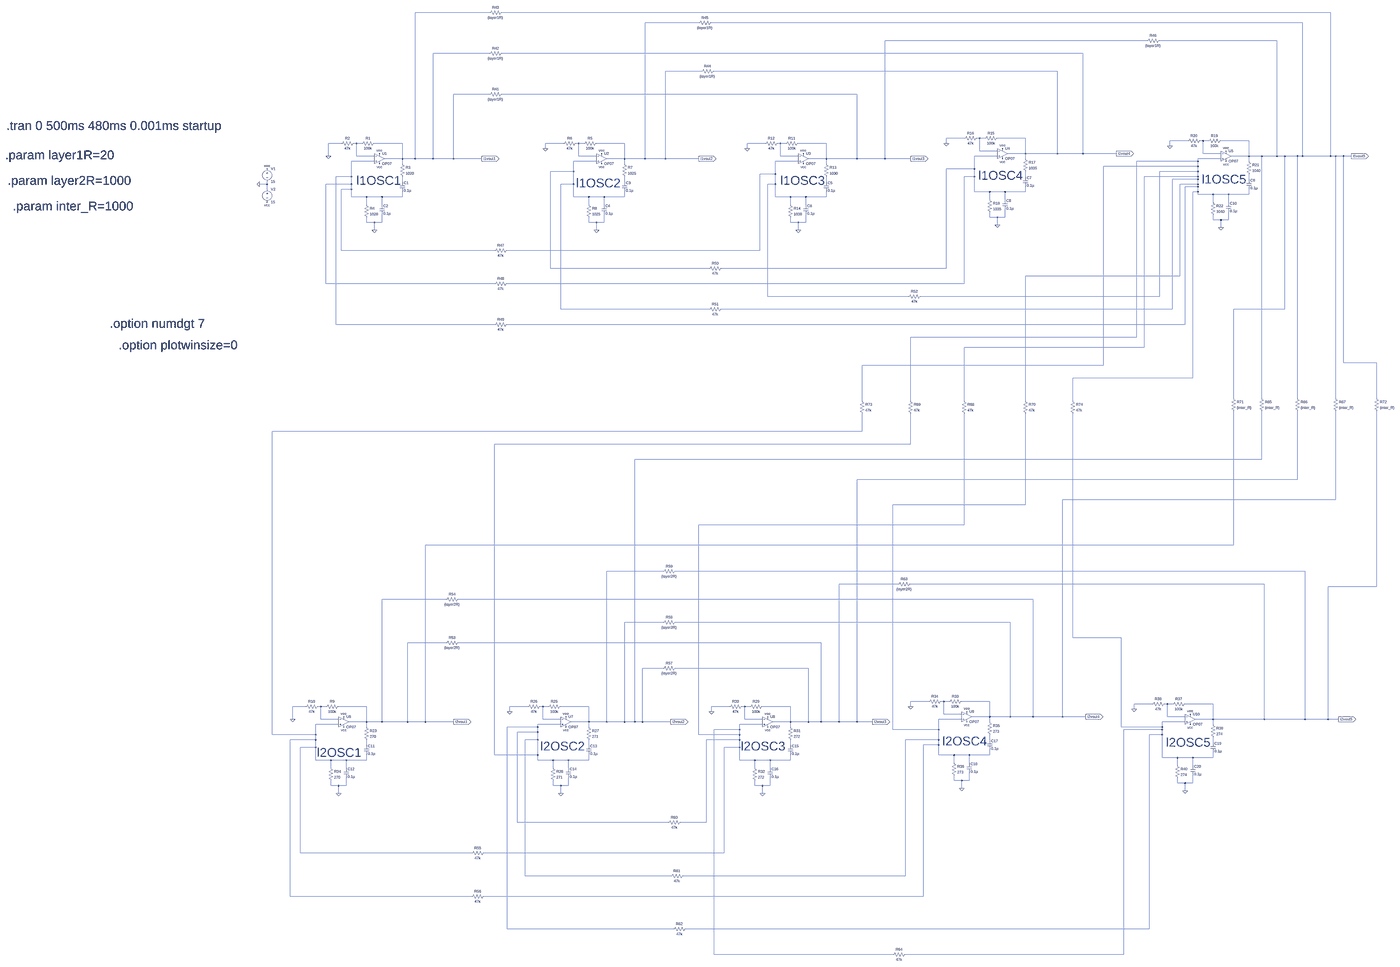
[diagram p0: schematic coupled_wein_bridge.asc, whole sheet]
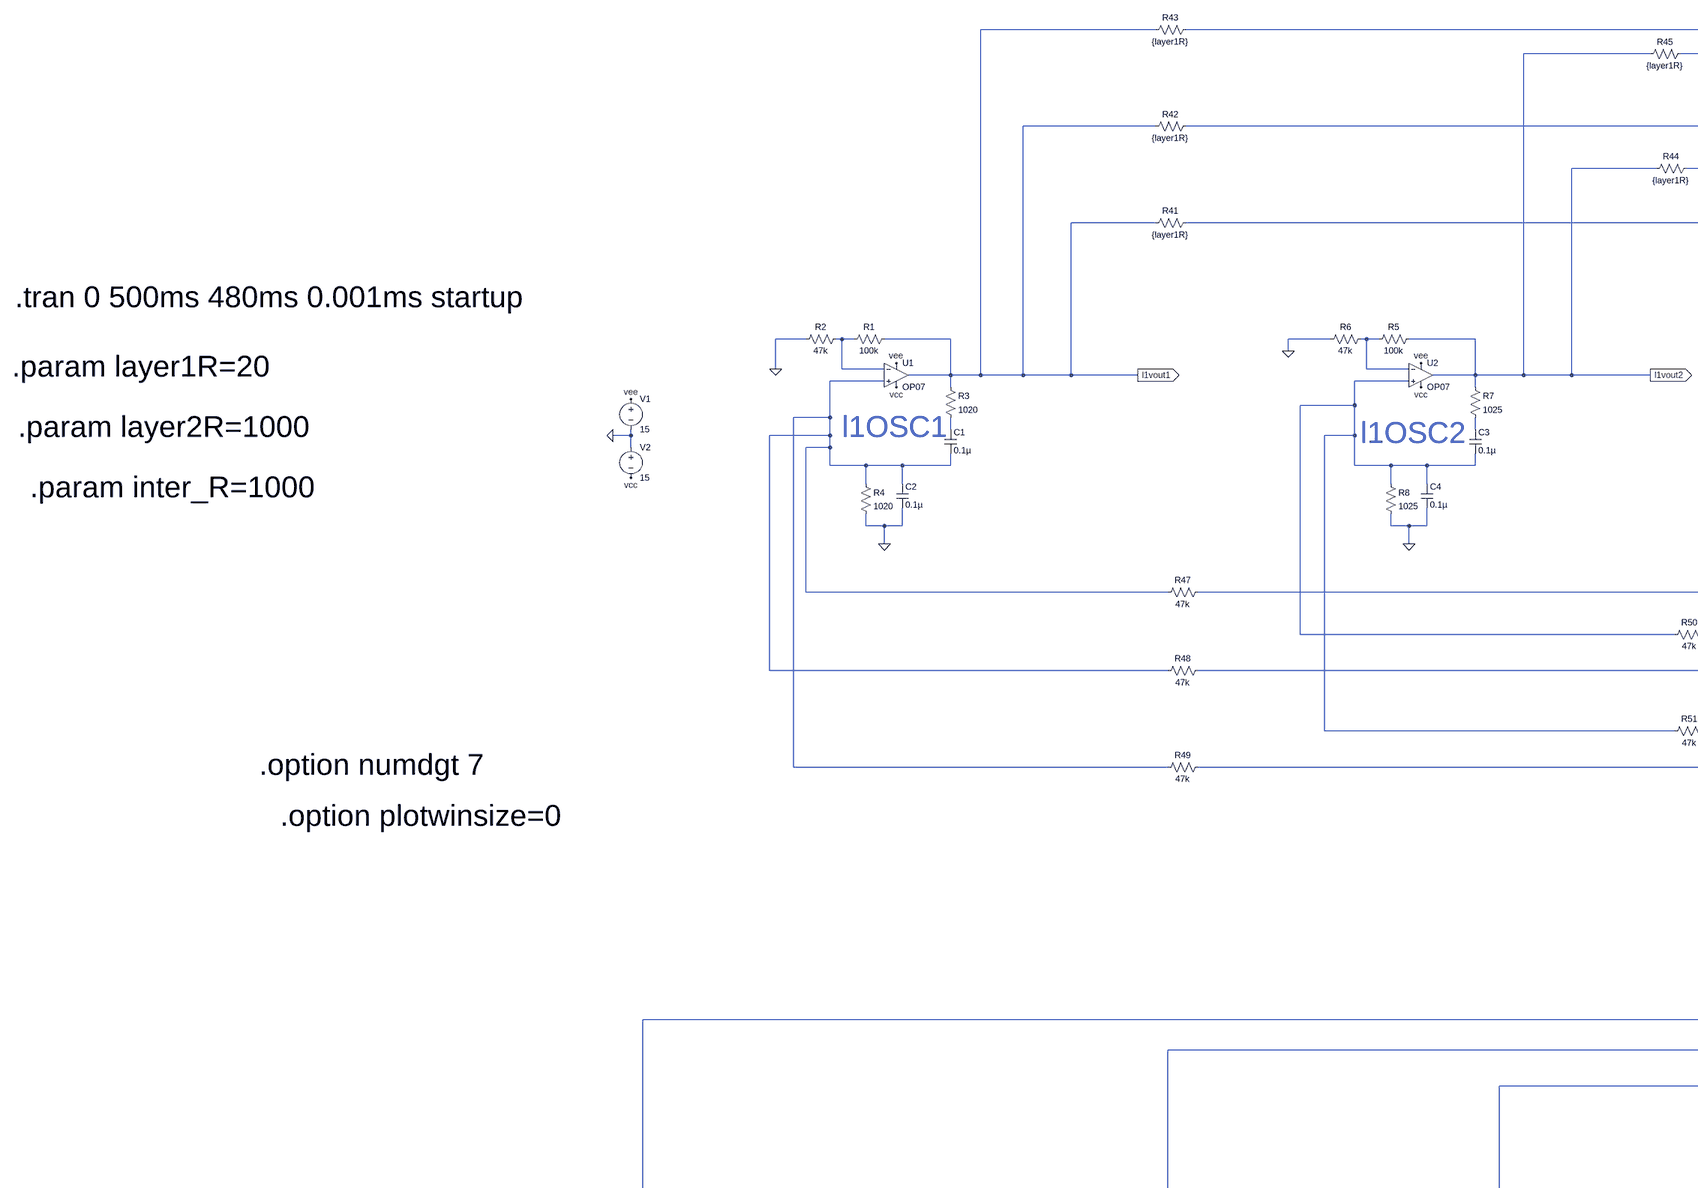
[diagram p1: schematic coupled_wein_bridge.asc, part, row 1 of 2, column 1 of 2]
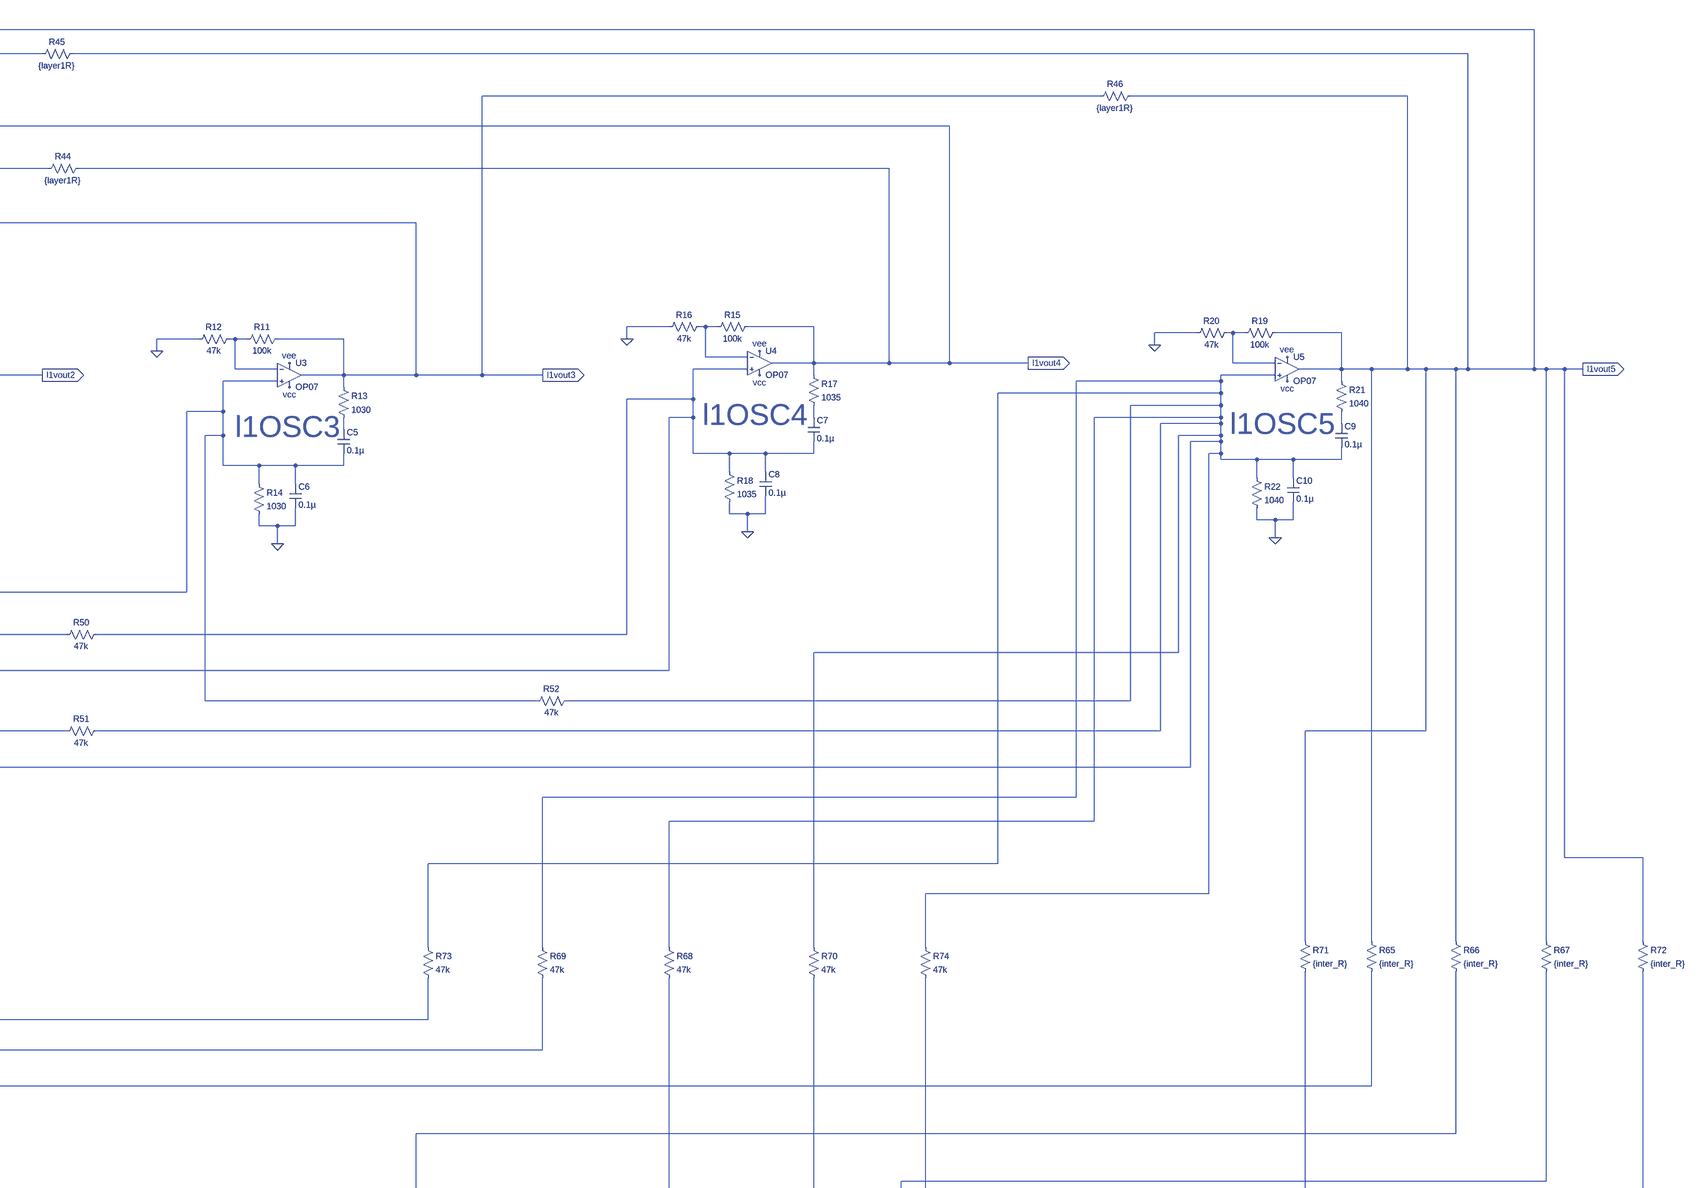
[diagram p2: schematic coupled_wein_bridge.asc, part, row 1 of 2, column 2 of 2]
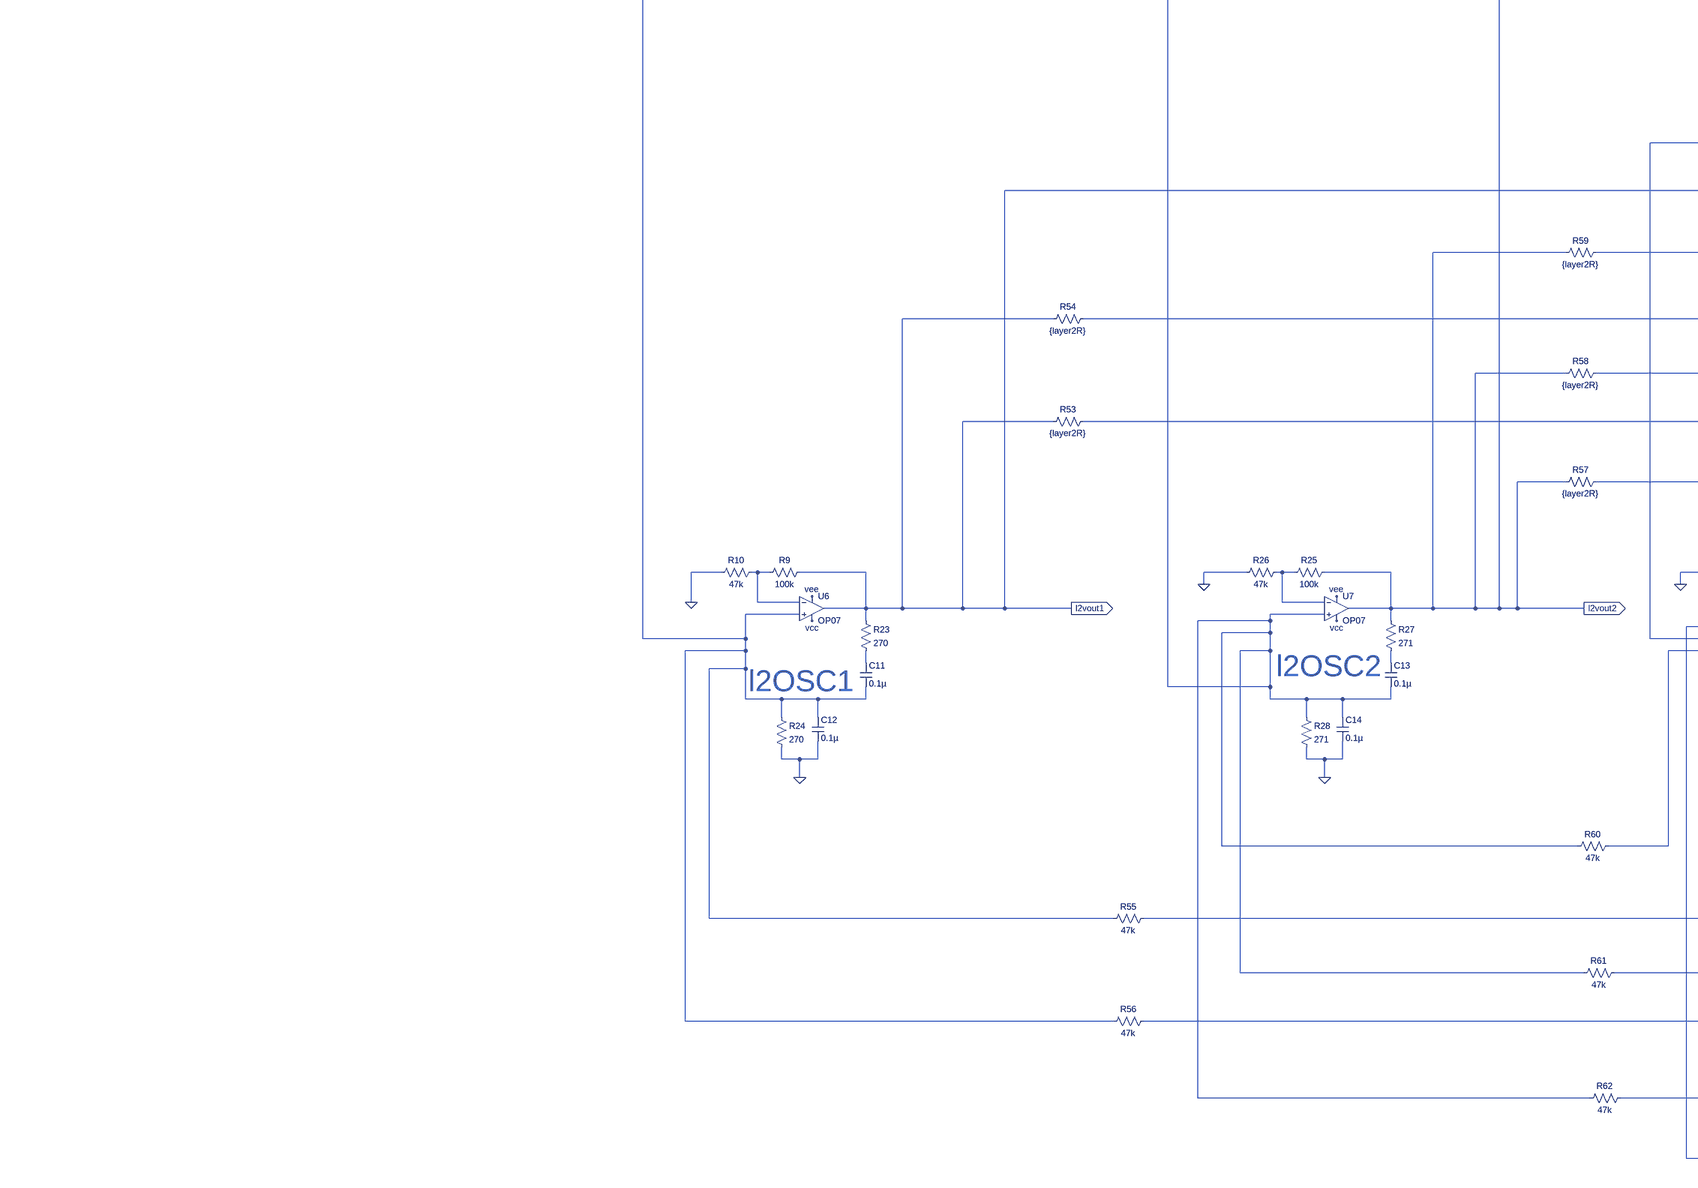
[diagram p3: schematic coupled_wein_bridge.asc, part, row 2 of 2, column 1 of 2]
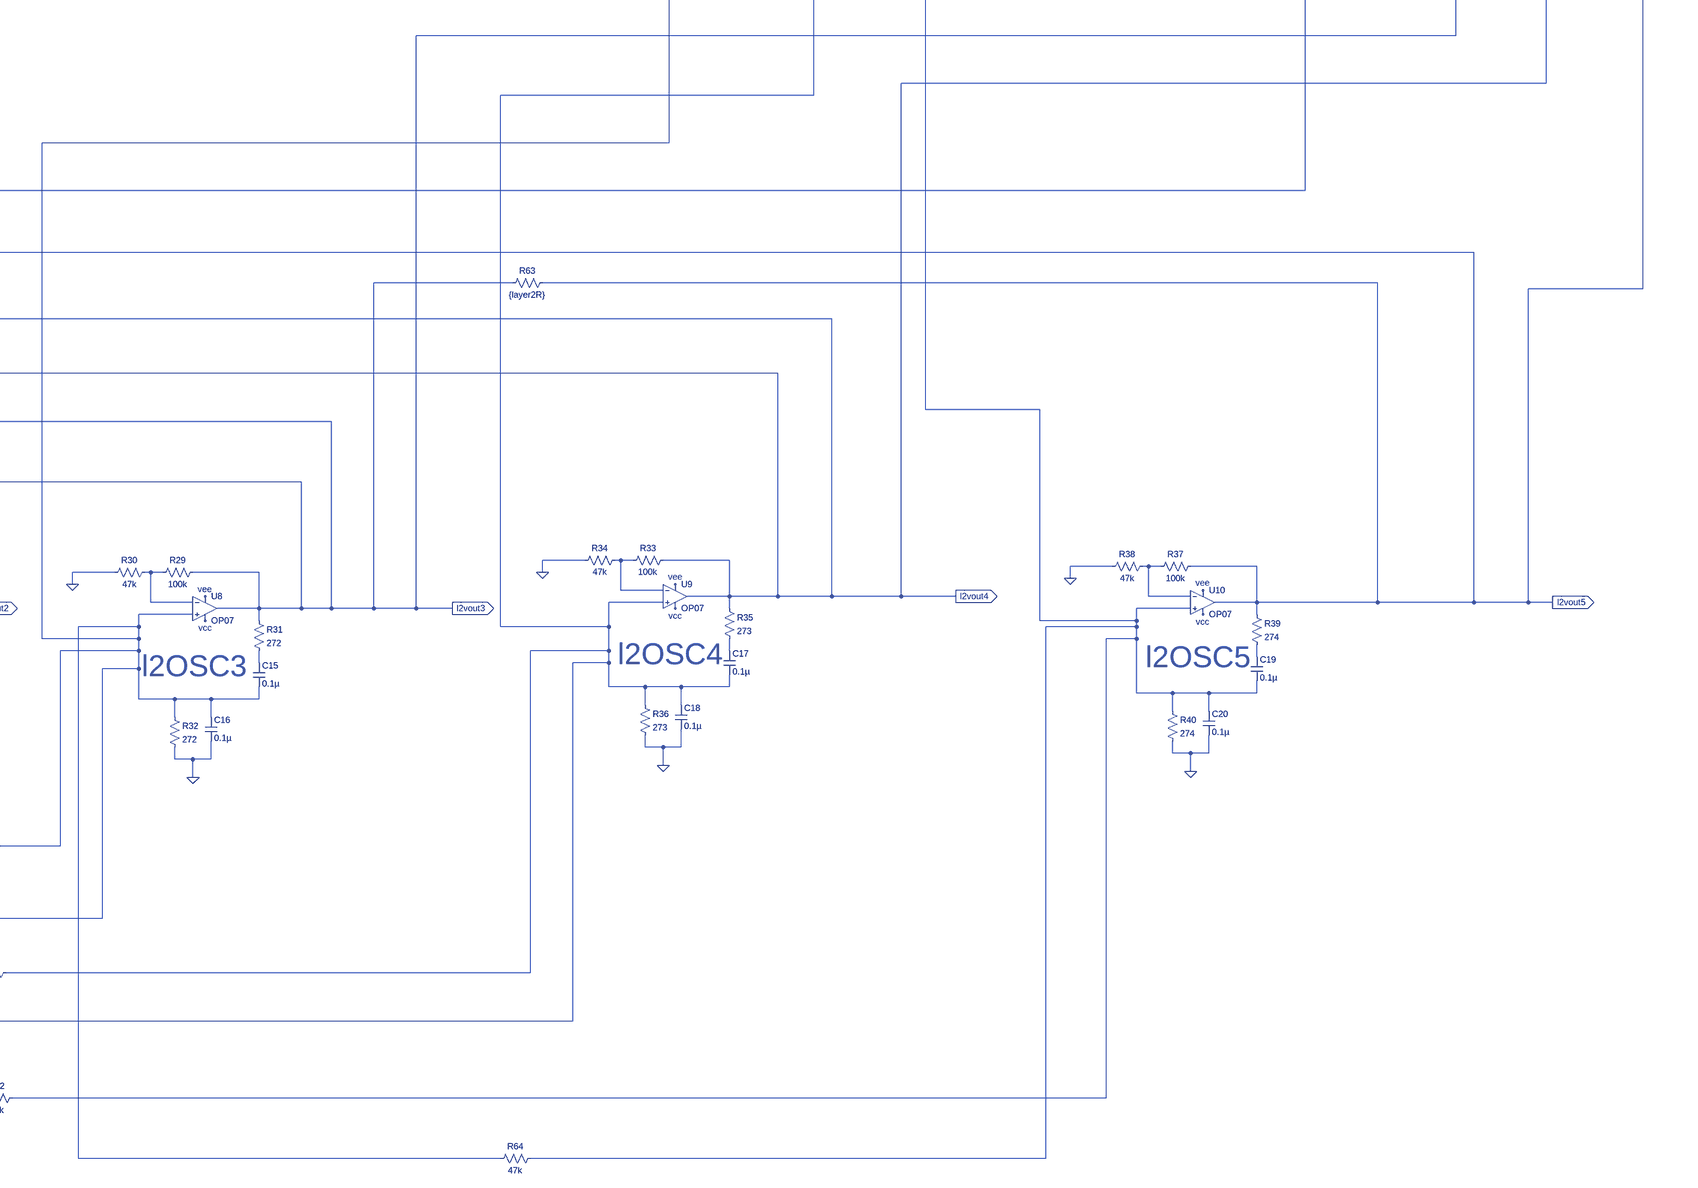
[diagram p4: schematic coupled_wein_bridge.asc, part, row 2 of 2, column 2 of 2]
coupled_wein_bridge.asc, the LTspice schematic file:
Version 4.1
SHEET 1 3756 6144
WIRE -2496 -688 -2960 -688
WIRE 2784 -688 -2416 -688
WIRE -1184 -624 -1520 -624
WIRE 2608 -624 -1104 -624
WIRE 1632 -512 -16 -512
WIRE 2448 -512 1712 -512
WIRE -2496 -432 -2848 -432
WIRE 1232 -432 -2416 -432
WIRE -1168 -320 -1392 -320
WIRE 1072 -320 -1088 -320
WIRE -2496 -176 -2720 -176
WIRE -192 -176 -2416 -176
WIRE 480 128 368 128
WIRE 576 128 560 128
WIRE 608 128 576 128
WIRE 864 128 688 128
WIRE 1888 144 1776 144
WIRE 1984 144 1968 144
WIRE 2016 144 1984 144
WIRE 2272 144 2096 144
WIRE -3424 160 -3504 160
WIRE -3328 160 -3344 160
WIRE -3296 160 -3328 160
WIRE -3040 160 -3216 160
WIRE -2032 160 -2144 160
WIRE -1936 160 -1952 160
WIRE -1904 160 -1936 160
WIRE -1648 160 -1824 160
WIRE -768 160 -880 160
WIRE -672 160 -688 160
WIRE -640 160 -672 160
WIRE -384 160 -560 160
WIRE 368 160 368 128
WIRE 1776 176 1776 144
WIRE -2144 192 -2144 160
WIRE -880 192 -880 160
WIRE 576 208 576 128
WIRE 688 208 576 208
WIRE 864 224 864 128
WIRE 864 224 752 224
WIRE 1072 224 1072 -320
WIRE 1072 224 864 224
WIRE 1232 224 1232 -432
WIRE 1232 224 1072 224
WIRE 1440 224 1232 224
WIRE 1984 224 1984 144
WIRE 2096 224 1984 224
WIRE -3504 240 -3504 160
WIRE -3328 240 -3328 160
WIRE -3216 240 -3328 240
WIRE -1936 240 -1936 160
WIRE -1824 240 -1936 240
WIRE -672 240 -672 160
WIRE -560 240 -672 240
WIRE 688 240 544 240
WIRE 2272 240 2272 144
WIRE 2272 240 2160 240
WIRE 2352 240 2272 240
WIRE 2448 240 2448 -512
WIRE 2448 240 2352 240
WIRE 2496 240 2448 240
WIRE 2576 240 2496 240
WIRE 2608 240 2608 -624
WIRE 2608 240 2576 240
WIRE 2784 240 2784 -688
WIRE 2784 240 2608 240
WIRE 2816 240 2784 240
WIRE 2864 240 2816 240
WIRE 2912 240 2864 240
WIRE -3040 256 -3040 160
WIRE -3040 256 -3152 256
WIRE -2960 256 -2960 -688
WIRE -2960 256 -3040 256
WIRE -2848 256 -2848 -432
WIRE -2848 256 -2960 256
WIRE -2720 256 -2720 -176
WIRE -2720 256 -2848 256
WIRE -2544 256 -2720 256
WIRE -1648 256 -1648 160
WIRE -1648 256 -1760 256
WIRE -1520 256 -1520 -624
WIRE -1520 256 -1648 256
WIRE -1392 256 -1392 -320
WIRE -1392 256 -1520 256
WIRE -1184 256 -1392 256
WIRE -384 256 -384 160
WIRE -384 256 -496 256
WIRE -192 256 -192 -176
WIRE -192 256 -384 256
WIRE -16 256 -16 -512
WIRE -16 256 -192 256
WIRE 144 256 -16 256
WIRE 864 256 864 224
WIRE 2096 256 1952 256
WIRE -3216 272 -3360 272
WIRE -1824 272 -1968 272
WIRE -560 272 -704 272
WIRE 1952 272 1952 256
WIRE 1952 272 1568 272
WIRE 2272 272 2272 240
WIRE -3040 288 -3040 256
WIRE -1648 288 -1648 256
WIRE -384 288 -384 256
WIRE 1952 304 1952 272
WIRE 1952 304 1360 304
WIRE 544 320 544 240
WIRE 544 320 368 320
WIRE -1968 336 -1968 272
WIRE -1968 336 -2112 336
WIRE 1952 336 1952 304
WIRE 1952 336 1712 336
WIRE -704 352 -704 272
WIRE -704 352 -800 352
WIRE -3360 368 -3360 272
WIRE -3360 368 -3456 368
WIRE 544 368 544 320
WIRE 544 368 480 368
WIRE 864 368 864 336
WIRE 1952 368 1952 336
WIRE 1952 368 1616 368
WIRE 1952 384 1952 368
WIRE 1952 384 1792 384
WIRE 2272 384 2272 352
WIRE -3040 400 -3040 368
WIRE -1648 400 -1648 368
WIRE -384 400 -384 368
WIRE -3888 416 -3888 400
WIRE -3888 416 -3936 416
WIRE -3360 416 -3360 368
WIRE -3360 416 -3520 416
WIRE -1968 416 -1968 336
WIRE -1968 416 -2048 416
WIRE -704 416 -704 352
WIRE -704 416 -752 416
WIRE 1952 416 1952 384
WIRE 1952 416 1840 416
WIRE 1952 432 1952 416
WIRE 1952 432 1872 432
WIRE -3888 448 -3888 416
WIRE -3360 448 -3360 416
WIRE -3360 448 -3424 448
WIRE 544 464 544 368
WIRE 640 464 544 464
WIRE 736 464 640 464
WIRE 864 464 864 432
WIRE 864 464 736 464
WIRE 1952 464 1952 432
WIRE 1952 464 1920 464
WIRE 1952 480 1952 464
WIRE 2048 480 1952 480
WIRE 2144 480 2048 480
WIRE 2272 480 2272 448
WIRE 2272 480 2144 480
WIRE -3360 496 -3360 448
WIRE -3264 496 -3360 496
WIRE -3168 496 -3264 496
WIRE -3040 496 -3040 464
WIRE -3040 496 -3168 496
WIRE -1968 496 -1968 416
WIRE -1872 496 -1968 496
WIRE -1776 496 -1872 496
WIRE -1648 496 -1648 464
WIRE -1648 496 -1776 496
WIRE -704 496 -704 416
WIRE -608 496 -704 496
WIRE -512 496 -608 496
WIRE -384 496 -384 464
WIRE -384 496 -512 496
WIRE 640 512 640 464
WIRE 736 512 736 464
WIRE 2048 528 2048 480
WIRE 2144 528 2144 480
WIRE -3264 544 -3264 496
WIRE -3168 544 -3168 496
WIRE -1872 544 -1872 496
WIRE -1776 544 -1776 496
WIRE -608 544 -608 496
WIRE -512 544 -512 496
WIRE 640 624 640 592
WIRE 688 624 640 624
WIRE 736 624 736 576
WIRE 736 624 688 624
WIRE 2048 640 2048 608
WIRE 2096 640 2048 640
WIRE 2144 640 2144 592
WIRE 2144 640 2096 640
WIRE -3264 656 -3264 624
WIRE -3216 656 -3264 656
WIRE -3168 656 -3168 608
WIRE -3168 656 -3216 656
WIRE -1872 656 -1872 624
WIRE -1824 656 -1872 656
WIRE -1776 656 -1776 608
WIRE -1776 656 -1824 656
WIRE -608 656 -608 624
WIRE -560 656 -608 656
WIRE -512 656 -512 608
WIRE -512 656 -560 656
WIRE 688 672 688 624
WIRE 2096 688 2096 640
WIRE -3216 704 -3216 656
WIRE -1824 704 -1824 656
WIRE -560 704 -560 656
WIRE -3424 832 -3424 448
WIRE -2464 832 -3424 832
WIRE -800 832 -800 352
WIRE -800 832 -2384 832
WIRE -2112 944 -2112 336
WIRE -1120 944 -2112 944
WIRE 368 944 368 320
WIRE 368 944 -1040 944
WIRE 1840 992 1840 416
WIRE 1840 992 864 992
WIRE -3520 1040 -3520 416
WIRE -2464 1040 -3520 1040
WIRE 480 1040 480 368
WIRE 480 1040 -2384 1040
WIRE -752 1120 -752 416
WIRE 128 1120 -752 1120
WIRE 1712 1120 1712 336
WIRE 1712 1120 208 1120
WIRE -2048 1200 -2048 416
WIRE -1120 1200 -2048 1200
WIRE 1792 1200 1792 384
WIRE 1792 1200 -1040 1200
WIRE 2496 1200 2496 240
WIRE 2496 1200 2176 1200
WIRE -3456 1296 -3456 368
WIRE -2464 1296 -3456 1296
WIRE 1872 1296 1872 432
WIRE 1872 1296 -2384 1296
WIRE 1568 1376 1568 272
WIRE 1568 1376 144 1376
WIRE 1616 1440 1616 368
WIRE 1616 1440 480 1440
WIRE 2864 1536 2864 240
WIRE 3072 1536 2864 1536
WIRE 1360 1552 1360 304
WIRE 1360 1552 -160 1552
WIRE 1920 1632 1920 464
WIRE 1920 1632 1168 1632
WIRE 2176 1776 2176 1200
WIRE 2352 1776 2352 240
WIRE 2576 1776 2576 240
WIRE 2816 1776 2816 240
WIRE 3072 1776 3072 1536
WIRE -160 1792 -160 1552
WIRE 144 1792 144 1376
WIRE 480 1792 480 1440
WIRE 864 1792 864 992
WIRE 1168 1792 1168 1632
WIRE -160 1984 -160 1872
WIRE -160 1984 -3856 1984
WIRE 144 2064 144 1872
WIRE 144 2064 -2464 2064
WIRE 2352 2160 2352 1856
WIRE 2352 2160 -1584 2160
WIRE 2576 2368 2576 1856
WIRE 2576 2368 -192 2368
WIRE 2816 2560 2816 1856
WIRE 2816 2560 1104 2560
WIRE 864 2592 864 1872
WIRE 864 2592 32 2592
WIRE 480 3056 480 1872
WIRE 480 3056 -1184 3056
WIRE 2176 3280 2176 1856
WIRE 2176 3280 -2896 3280
WIRE -1408 3536 -1760 3536
WIRE 2624 3536 -1328 3536
WIRE 64 3616 -304 3616
WIRE 2368 3616 144 3616
WIRE 3072 3632 3072 1856
WIRE 3072 3632 2768 3632
WIRE -2768 3712 -3168 3712
WIRE 912 3712 -2688 3712
WIRE -1408 3856 -1648 3856
WIRE 768 3856 -1328 3856
WIRE 1168 3952 1168 1872
WIRE 1472 3952 1168 3952
WIRE -2768 3984 -3008 3984
WIRE -416 3984 -2688 3984
WIRE -1408 4144 -1536 4144
WIRE -496 4144 -1328 4144
WIRE 256 4368 144 4368
WIRE 352 4368 336 4368
WIRE 384 4368 352 4368
WIRE 640 4368 464 4368
WIRE 1664 4384 1552 4384
WIRE 1760 4384 1744 4384
WIRE 1792 4384 1760 4384
WIRE 2048 4384 1872 4384
WIRE -3648 4400 -3728 4400
WIRE -3552 4400 -3568 4400
WIRE -3520 4400 -3552 4400
WIRE -3264 4400 -3440 4400
WIRE -2256 4400 -2368 4400
WIRE -2160 4400 -2176 4400
WIRE -2128 4400 -2160 4400
WIRE -1872 4400 -2048 4400
WIRE -992 4400 -1104 4400
WIRE -896 4400 -912 4400
WIRE -864 4400 -896 4400
WIRE -608 4400 -784 4400
WIRE 144 4400 144 4368
WIRE 1552 4416 1552 4384
WIRE -2368 4432 -2368 4400
WIRE -1104 4432 -1104 4400
WIRE 352 4448 352 4368
WIRE 464 4448 352 4448
WIRE 640 4464 640 4368
WIRE 640 4464 528 4464
WIRE 768 4464 768 3856
WIRE 768 4464 640 4464
WIRE 912 4464 912 3712
WIRE 912 4464 768 4464
WIRE 1104 4464 1104 2560
WIRE 1104 4464 912 4464
WIRE 1248 4464 1104 4464
WIRE 1760 4464 1760 4384
WIRE 1872 4464 1760 4464
WIRE -3728 4480 -3728 4400
WIRE -3552 4480 -3552 4400
WIRE -3440 4480 -3552 4480
WIRE -2160 4480 -2160 4400
WIRE -2048 4480 -2160 4480
WIRE -896 4480 -896 4400
WIRE -784 4480 -896 4480
WIRE 464 4480 320 4480
WIRE 2048 4480 2048 4384
WIRE 2048 4480 1936 4480
WIRE 2368 4480 2368 3616
WIRE 2368 4480 2048 4480
WIRE 2624 4480 2624 3536
WIRE 2624 4480 2368 4480
WIRE 2768 4480 2768 3632
WIRE 2768 4480 2624 4480
WIRE 2832 4480 2768 4480
WIRE -3264 4496 -3264 4400
WIRE -3264 4496 -3376 4496
WIRE -3168 4496 -3168 3712
WIRE -3168 4496 -3264 4496
WIRE -3008 4496 -3008 3984
WIRE -3008 4496 -3168 4496
WIRE -2896 4496 -2896 3280
WIRE -2896 4496 -3008 4496
WIRE -2720 4496 -2896 4496
WIRE -1872 4496 -1872 4400
WIRE -1872 4496 -1984 4496
WIRE -1760 4496 -1760 3536
WIRE -1760 4496 -1872 4496
WIRE -1648 4496 -1648 3856
WIRE -1648 4496 -1760 4496
WIRE -1584 4496 -1584 2160
WIRE -1584 4496 -1648 4496
WIRE -1536 4496 -1536 4144
WIRE -1536 4496 -1584 4496
WIRE -1360 4496 -1536 4496
WIRE -608 4496 -608 4400
WIRE -608 4496 -720 4496
WIRE -496 4496 -496 4144
WIRE -496 4496 -608 4496
WIRE -416 4496 -416 3984
WIRE -416 4496 -496 4496
WIRE -304 4496 -304 3616
WIRE -304 4496 -416 4496
WIRE -192 4496 -192 2368
WIRE -192 4496 -304 4496
WIRE -96 4496 -192 4496
WIRE 640 4496 640 4464
WIRE 1872 4496 1728 4496
WIRE -3440 4512 -3584 4512
WIRE -2048 4512 -2192 4512
WIRE -784 4512 -928 4512
WIRE 2048 4512 2048 4480
WIRE -3264 4528 -3264 4496
WIRE -2192 4528 -2192 4512
WIRE -2192 4528 -2384 4528
WIRE -1872 4528 -1872 4496
WIRE -608 4528 -608 4496
WIRE 1472 4528 1472 3952
WIRE 1728 4528 1728 4496
WIRE 1728 4528 1472 4528
WIRE -928 4544 -928 4512
WIRE -928 4544 -1088 4544
WIRE 32 4544 32 2592
WIRE 320 4544 320 4480
WIRE 320 4544 32 4544
WIRE 1728 4544 1728 4528
WIRE 1728 4544 1488 4544
WIRE -2192 4560 -2192 4528
WIRE -2192 4560 -2320 4560
WIRE -3856 4576 -3856 1984
WIRE -3584 4576 -3584 4512
WIRE -3584 4576 -3856 4576
WIRE -1184 4576 -1184 3056
WIRE -928 4576 -928 4544
WIRE -928 4576 -1184 4576
WIRE 1728 4576 1728 4544
WIRE 1728 4576 1648 4576
WIRE -3584 4608 -3584 4576
WIRE -3584 4608 -3744 4608
WIRE -2192 4608 -2192 4560
WIRE -2192 4608 -2272 4608
WIRE -928 4608 -928 4576
WIRE -928 4608 -1136 4608
WIRE 320 4608 320 4544
WIRE 320 4608 112 4608
WIRE 640 4608 640 4576
WIRE 2048 4624 2048 4592
WIRE -3264 4640 -3264 4608
WIRE -1872 4640 -1872 4608
WIRE -608 4640 -608 4608
WIRE 320 4640 320 4608
WIRE 320 4640 224 4640
WIRE -3584 4656 -3584 4608
WIRE -3584 4656 -3680 4656
WIRE -928 4656 -928 4608
WIRE -928 4656 -1024 4656
WIRE -2464 4704 -2464 2064
WIRE -2192 4704 -2192 4608
WIRE -2192 4704 -2464 4704
WIRE 320 4704 320 4640
WIRE 416 4704 320 4704
WIRE 512 4704 416 4704
WIRE 640 4704 640 4672
WIRE 640 4704 512 4704
WIRE 1728 4720 1728 4576
WIRE 1824 4720 1728 4720
WIRE 1920 4720 1824 4720
WIRE 2048 4720 2048 4688
WIRE 2048 4720 1920 4720
WIRE -3584 4736 -3584 4656
WIRE -3488 4736 -3584 4736
WIRE -3392 4736 -3488 4736
WIRE -3264 4736 -3264 4704
WIRE -3264 4736 -3392 4736
WIRE -2192 4736 -2192 4704
WIRE -2096 4736 -2192 4736
WIRE -2000 4736 -2096 4736
WIRE -1872 4736 -1872 4704
WIRE -1872 4736 -2000 4736
WIRE -928 4736 -928 4656
WIRE -832 4736 -928 4736
WIRE -736 4736 -832 4736
WIRE -608 4736 -608 4704
WIRE -608 4736 -736 4736
WIRE 416 4752 416 4704
WIRE 512 4752 512 4704
WIRE 1824 4768 1824 4720
WIRE 1920 4768 1920 4720
WIRE -3488 4784 -3488 4736
WIRE -3392 4784 -3392 4736
WIRE -2096 4784 -2096 4736
WIRE -2000 4784 -2000 4736
WIRE -832 4784 -832 4736
WIRE -736 4784 -736 4736
WIRE 416 4864 416 4832
WIRE 464 4864 416 4864
WIRE 512 4864 512 4816
WIRE 512 4864 464 4864
WIRE 1824 4880 1824 4848
WIRE 1872 4880 1824 4880
WIRE 1920 4880 1920 4832
WIRE 1920 4880 1872 4880
WIRE -3488 4896 -3488 4864
WIRE -3440 4896 -3488 4896
WIRE -3392 4896 -3392 4848
WIRE -3392 4896 -3440 4896
WIRE -2096 4896 -2096 4864
WIRE -2048 4896 -2096 4896
WIRE -2000 4896 -2000 4848
WIRE -2000 4896 -2048 4896
WIRE -832 4896 -832 4864
WIRE -784 4896 -832 4896
WIRE -736 4896 -736 4848
WIRE -736 4896 -784 4896
WIRE 464 4912 464 4864
WIRE 1872 4928 1872 4880
WIRE -3440 4944 -3440 4896
WIRE -2048 4944 -2048 4896
WIRE -784 4944 -784 4896
WIRE -2320 5248 -2320 4560
WIRE -1376 5248 -2320 5248
WIRE -1136 5248 -1136 4608
WIRE -1136 5248 -1296 5248
WIRE -3680 5440 -3680 4656
WIRE -2608 5440 -3680 5440
WIRE -1024 5440 -1024 4656
WIRE -1024 5440 -2528 5440
WIRE -2272 5584 -2272 4608
WIRE -1360 5584 -2272 5584
WIRE 112 5584 112 4608
WIRE 112 5584 -1280 5584
WIRE -3744 5712 -3744 4608
WIRE -2608 5712 -3744 5712
WIRE 224 5712 224 4640
WIRE 224 5712 -2528 5712
WIRE -2384 5936 -2384 4528
WIRE -1344 5936 -2384 5936
WIRE 1648 5936 1648 4576
WIRE 1648 5936 -1264 5936
WIRE -1088 6096 -1088 4544
WIRE 32 6096 -1088 6096
WIRE 1488 6096 1488 4544
WIRE 1488 6096 112 6096
FLAG -3936 416 0
FLAG -3888 320 vee
FLAG -3888 528 vcc
FLAG -3184 224 vee
FLAG -3184 288 vcc
FLAG -3216 704 0
FLAG -2544 256 l1vout1
IOPIN -2544 256 Out
FLAG -1792 224 vee
FLAG -1792 288 vcc
FLAG -1824 704 0
FLAG -1184 256 l1vout2
IOPIN -1184 256 Out
FLAG -3504 240 0
FLAG -2144 192 0
FLAG -528 224 vee
FLAG -528 288 vcc
FLAG -560 704 0
FLAG 144 256 l1vout3
IOPIN 144 256 Out
FLAG -880 192 0
FLAG 720 192 vee
FLAG 720 256 vcc
FLAG 688 672 0
FLAG 1440 224 l1vout4
IOPIN 1440 224 Out
FLAG 368 160 0
FLAG 2128 208 vee
FLAG 2128 272 vcc
FLAG 2096 688 0
FLAG 2912 240 l1vout5
IOPIN 2912 240 Out
FLAG 1776 176 0
FLAG -3408 4464 vee
FLAG -3408 4528 vcc
FLAG -3440 4944 0
FLAG -2720 4496 l2vout1
IOPIN -2720 4496 Out
FLAG -2016 4464 vee
FLAG -2016 4528 vcc
FLAG -2048 4944 0
FLAG -1360 4496 l2vout2
IOPIN -1360 4496 Out
FLAG -3728 4480 0
FLAG -2368 4432 0
FLAG -752 4464 vee
FLAG -752 4528 vcc
FLAG -784 4944 0
FLAG -96 4496 l2vout3
IOPIN -96 4496 Out
FLAG -1104 4432 0
FLAG 496 4432 vee
FLAG 496 4496 vcc
FLAG 464 4912 0
FLAG 1248 4464 l2vout4
IOPIN 1248 4464 Out
FLAG 144 4400 0
FLAG 1904 4448 vee
FLAG 1904 4512 vcc
FLAG 1872 4928 0
FLAG 2832 4480 l2vout5
IOPIN 2832 4480 Out
FLAG 1552 4416 0
SYMBOL voltage -3888 304 R0
SYMATTR InstName V1
SYMATTR Value 15
SYMBOL voltage -3888 432 R0
SYMATTR InstName V2
SYMATTR Value 15
SYMBOL OpAmps\\OP07 -3184 192 R0
SYMATTR InstName U1
SYMBOL res -3200 144 R90
WINDOW 0 0 56 VBottom 2
WINDOW 3 32 56 VTop 2
SYMATTR InstName R1
SYMATTR Value 100k
SYMBOL res -3328 144 R90
WINDOW 0 0 56 VBottom 2
WINDOW 3 32 56 VTop 2
SYMATTR InstName R2
SYMATTR Value 47k
SYMBOL res -3056 272 R0
SYMATTR InstName R3
SYMATTR Value 1020
SYMBOL cap -3056 400 R0
SYMATTR InstName C1
SYMATTR Value 0.1µ
SYMBOL res -3280 528 R0
SYMATTR InstName R4
SYMATTR Value 1020
SYMBOL cap -3184 544 R0
SYMATTR InstName C2
SYMATTR Value 0.1µ
SYMBOL OpAmps\\OP07 -1792 192 R0
SYMATTR InstName U2
SYMBOL res -1808 144 R90
WINDOW 0 0 56 VBottom 2
WINDOW 3 32 56 VTop 2
SYMATTR InstName R5
SYMATTR Value 100k
SYMBOL res -1936 144 R90
WINDOW 0 0 56 VBottom 2
WINDOW 3 32 56 VTop 2
SYMATTR InstName R6
SYMATTR Value 47k
SYMBOL res -1664 272 R0
SYMATTR InstName R7
SYMATTR Value 1025
SYMBOL cap -1664 400 R0
SYMATTR InstName C3
SYMATTR Value 0.1µ
SYMBOL res -1888 528 R0
SYMATTR InstName R8
SYMATTR Value 1025
SYMBOL cap -1792 544 R0
SYMATTR InstName C4
SYMATTR Value 0.1µ
SYMBOL OpAmps\\OP07 -528 192 R0
SYMATTR InstName U3
SYMBOL res -544 144 R90
WINDOW 0 0 56 VBottom 2
WINDOW 3 32 56 VTop 2
SYMATTR InstName R11
SYMATTR Value 100k
SYMBOL res -672 144 R90
WINDOW 0 0 56 VBottom 2
WINDOW 3 32 56 VTop 2
SYMATTR InstName R12
SYMATTR Value 47k
SYMBOL res -400 272 R0
SYMATTR InstName R13
SYMATTR Value 1030
SYMBOL cap -400 400 R0
SYMATTR InstName C5
SYMATTR Value 0.1µ
SYMBOL res -624 528 R0
SYMATTR InstName R14
SYMATTR Value 1030
SYMBOL cap -528 544 R0
SYMATTR InstName C6
SYMATTR Value 0.1µ
SYMBOL OpAmps\\OP07 720 160 R0
SYMATTR InstName U4
SYMBOL res 704 112 R90
WINDOW 0 0 56 VBottom 2
WINDOW 3 32 56 VTop 2
SYMATTR InstName R15
SYMATTR Value 100k
SYMBOL res 576 112 R90
WINDOW 0 0 56 VBottom 2
WINDOW 3 32 56 VTop 2
SYMATTR InstName R16
SYMATTR Value 47k
SYMBOL res 848 240 R0
SYMATTR InstName R17
SYMATTR Value 1035
SYMBOL cap 848 368 R0
SYMATTR InstName C7
SYMATTR Value 0.1µ
SYMBOL res 624 496 R0
SYMATTR InstName R18
SYMATTR Value 1035
SYMBOL cap 720 512 R0
SYMATTR InstName C8
SYMATTR Value 0.1µ
SYMBOL OpAmps\\OP07 2128 176 R0
SYMATTR InstName U5
SYMBOL res 2112 128 R90
WINDOW 0 0 56 VBottom 2
WINDOW 3 32 56 VTop 2
SYMATTR InstName R19
SYMATTR Value 100k
SYMBOL res 1984 128 R90
WINDOW 0 0 56 VBottom 2
WINDOW 3 32 56 VTop 2
SYMATTR InstName R20
SYMATTR Value 47k
SYMBOL res 2256 256 R0
SYMATTR InstName R21
SYMATTR Value 1040
SYMBOL cap 2256 384 R0
SYMATTR InstName C9
SYMATTR Value 0.1µ
SYMBOL res 2032 512 R0
SYMATTR InstName R22
SYMATTR Value 1040
SYMBOL cap 2128 528 R0
SYMATTR InstName C10
SYMATTR Value 0.1µ
SYMBOL OpAmps\\OP07 -3408 4432 R0
SYMATTR InstName U6
SYMBOL res -3424 4384 R90
WINDOW 0 0 56 VBottom 2
WINDOW 3 32 56 VTop 2
SYMATTR InstName R9
SYMATTR Value 100k
SYMBOL res -3552 4384 R90
WINDOW 0 0 56 VBottom 2
WINDOW 3 32 56 VTop 2
SYMATTR InstName R10
SYMATTR Value 47k
SYMBOL res -3280 4512 R0
SYMATTR InstName R23
SYMATTR Value 270
SYMBOL cap -3280 4640 R0
SYMATTR InstName C11
SYMATTR Value 0.1µ
SYMBOL res -3504 4768 R0
SYMATTR InstName R24
SYMATTR Value 270
SYMBOL cap -3408 4784 R0
SYMATTR InstName C12
SYMATTR Value 0.1µ
SYMBOL OpAmps\\OP07 -2016 4432 R0
SYMATTR InstName U7
SYMBOL res -2032 4384 R90
WINDOW 0 0 56 VBottom 2
WINDOW 3 32 56 VTop 2
SYMATTR InstName R25
SYMATTR Value 100k
SYMBOL res -2160 4384 R90
WINDOW 0 0 56 VBottom 2
WINDOW 3 32 56 VTop 2
SYMATTR InstName R26
SYMATTR Value 47k
SYMBOL res -1888 4512 R0
SYMATTR InstName R27
SYMATTR Value 271
SYMBOL cap -1888 4640 R0
SYMATTR InstName C13
SYMATTR Value 0.1µ
SYMBOL res -2112 4768 R0
SYMATTR InstName R28
SYMATTR Value 271
SYMBOL cap -2016 4784 R0
SYMATTR InstName C14
SYMATTR Value 0.1µ
SYMBOL OpAmps\\OP07 -752 4432 R0
SYMATTR InstName U8
SYMBOL res -768 4384 R90
WINDOW 0 0 56 VBottom 2
WINDOW 3 32 56 VTop 2
SYMATTR InstName R29
SYMATTR Value 100k
SYMBOL res -896 4384 R90
WINDOW 0 0 56 VBottom 2
WINDOW 3 32 56 VTop 2
SYMATTR InstName R30
SYMATTR Value 47k
SYMBOL res -624 4512 R0
SYMATTR InstName R31
SYMATTR Value 272
SYMBOL cap -624 4640 R0
SYMATTR InstName C15
SYMATTR Value 0.1µ
SYMBOL res -848 4768 R0
SYMATTR InstName R32
SYMATTR Value 272
SYMBOL cap -752 4784 R0
SYMATTR InstName C16
SYMATTR Value 0.1µ
SYMBOL OpAmps\\OP07 496 4400 R0
SYMATTR InstName U9
SYMBOL res 480 4352 R90
WINDOW 0 0 56 VBottom 2
WINDOW 3 32 56 VTop 2
SYMATTR InstName R33
SYMATTR Value 100k
SYMBOL res 352 4352 R90
WINDOW 0 0 56 VBottom 2
WINDOW 3 32 56 VTop 2
SYMATTR InstName R34
SYMATTR Value 47k
SYMBOL res 624 4480 R0
SYMATTR InstName R35
SYMATTR Value 273
SYMBOL cap 624 4608 R0
SYMATTR InstName C17
SYMATTR Value 0.1µ
SYMBOL res 400 4736 R0
SYMATTR InstName R36
SYMATTR Value 273
SYMBOL cap 496 4752 R0
SYMATTR InstName C18
SYMATTR Value 0.1µ
SYMBOL OpAmps\\OP07 1904 4416 R0
SYMATTR InstName U10
SYMBOL res 1888 4368 R90
WINDOW 0 0 56 VBottom 2
WINDOW 3 32 56 VTop 2
SYMATTR InstName R37
SYMATTR Value 100k
SYMBOL res 1760 4368 R90
WINDOW 0 0 56 VBottom 2
WINDOW 3 32 56 VTop 2
SYMATTR InstName R38
SYMATTR Value 47k
SYMBOL res 2032 4496 R0
SYMATTR InstName R39
SYMATTR Value 274
SYMBOL cap 2032 4624 R0
SYMATTR InstName C19
SYMATTR Value 0.1µ
SYMBOL res 1808 4752 R0
SYMATTR InstName R40
SYMATTR Value 274
SYMBOL cap 1904 4768 R0
SYMATTR InstName C20
SYMATTR Value 0.1µ
SYMBOL res -2400 -192 R90
WINDOW 0 0 56 VBottom 2
WINDOW 3 32 56 VTop 2
SYMATTR InstName R41
SYMATTR Value {layer1R}
SYMBOL res -2400 -448 R90
WINDOW 0 0 56 VBottom 2
WINDOW 3 32 56 VTop 2
SYMATTR InstName R42
SYMATTR Value {layer1R}
SYMBOL res -2400 -704 R90
WINDOW 0 0 56 VBottom 2
WINDOW 3 32 56 VTop 2
SYMATTR InstName R43
SYMATTR Value {layer1R}
SYMBOL res -1072 -336 R90
WINDOW 0 0 56 VBottom 2
WINDOW 3 32 56 VTop 2
SYMATTR InstName R44
SYMATTR Value {layer1R}
SYMBOL res -1088 -640 R90
WINDOW 0 0 56 VBottom 2
WINDOW 3 32 56 VTop 2
SYMATTR InstName R45
SYMATTR Value {layer1R}
SYMBOL res 1728 -528 R90
WINDOW 0 0 56 VBottom 2
WINDOW 3 32 56 VTop 2
SYMATTR InstName R46
SYMATTR Value {layer1R}
SYMBOL res -2368 816 R90
WINDOW 0 0 56 VBottom 2
WINDOW 3 32 56 VTop 2
SYMATTR InstName R47
SYMATTR Value 47k
SYMBOL res -2368 1024 R90
WINDOW 0 0 56 VBottom 2
WINDOW 3 32 56 VTop 2
SYMATTR InstName R48
SYMATTR Value 47k
SYMBOL res -2368 1280 R90
WINDOW 0 0 56 VBottom 2
WINDOW 3 32 56 VTop 2
SYMATTR InstName R49
SYMATTR Value 47k
SYMBOL res -1024 928 R90
WINDOW 0 0 56 VBottom 2
WINDOW 3 32 56 VTop 2
SYMATTR InstName R50
SYMATTR Value 47k
SYMBOL res -1024 1184 R90
WINDOW 0 0 56 VBottom 2
WINDOW 3 32 56 VTop 2
SYMATTR InstName R51
SYMATTR Value 47k
SYMBOL res 224 1104 R90
WINDOW 0 0 56 VBottom 2
WINDOW 3 32 56 VTop 2
SYMATTR InstName R52
SYMATTR Value 47k
SYMBOL res -2672 3968 R90
WINDOW 0 0 56 VBottom 2
WINDOW 3 32 56 VTop 2
SYMATTR InstName R53
SYMATTR Value {layer2R}
SYMBOL res -2672 3696 R90
WINDOW 0 0 56 VBottom 2
WINDOW 3 32 56 VTop 2
SYMATTR InstName R54
SYMATTR Value {layer2R}
SYMBOL res -2512 5424 R90
WINDOW 0 0 56 VBottom 2
WINDOW 3 32 56 VTop 2
SYMATTR InstName R55
SYMATTR Value 47k
SYMBOL res -2512 5696 R90
WINDOW 0 0 56 VBottom 2
WINDOW 3 32 56 VTop 2
SYMATTR InstName R56
SYMATTR Value 47k
SYMBOL res -1312 4128 R90
WINDOW 0 0 56 VBottom 2
WINDOW 3 32 56 VTop 2
SYMATTR InstName R57
SYMATTR Value {layer2R}
SYMBOL res -1312 3840 R90
WINDOW 0 0 56 VBottom 2
WINDOW 3 32 56 VTop 2
SYMATTR InstName R58
SYMATTR Value {layer2R}
SYMBOL res -1312 3520 R90
WINDOW 0 0 56 VBottom 2
WINDOW 3 32 56 VTop 2
SYMATTR InstName R59
SYMATTR Value {layer2R}
SYMBOL res -1280 5232 R90
WINDOW 0 0 56 VBottom 2
WINDOW 3 32 56 VTop 2
SYMATTR InstName R60
SYMATTR Value 47k
SYMBOL res -1264 5568 R90
WINDOW 0 0 56 VBottom 2
WINDOW 3 32 56 VTop 2
SYMATTR InstName R61
SYMATTR Value 47k
SYMBOL res -1248 5920 R90
WINDOW 0 0 56 VBottom 2
WINDOW 3 32 56 VTop 2
SYMATTR InstName R62
SYMATTR Value 47k
SYMBOL res 160 3600 R90
WINDOW 0 0 56 VBottom 2
WINDOW 3 32 56 VTop 2
SYMATTR InstName R63
SYMATTR Value {layer2R}
SYMBOL res 128 6080 R90
WINDOW 0 0 56 VBottom 2
WINDOW 3 32 56 VTop 2
SYMATTR InstName R64
SYMATTR Value 47k
SYMBOL res 2336 1760 R0
SYMATTR InstName R65
SYMATTR Value {inter_R}
SYMBOL res 2560 1760 R0
SYMATTR InstName R66
SYMATTR Value {inter_R}
SYMBOL res 2800 1760 R0
SYMATTR InstName R67
SYMATTR Value {inter_R}
SYMBOL res 464 1776 R0
SYMATTR InstName R68
SYMATTR Value 47k
SYMBOL res 128 1776 R0
SYMATTR InstName R69
SYMATTR Value 47k
SYMBOL res 848 1776 R0
SYMATTR InstName R70
SYMATTR Value 47k
SYMBOL res 2160 1760 R0
SYMATTR InstName R71
SYMATTR Value {inter_R}
SYMBOL res 3056 1760 R0
SYMATTR InstName R72
SYMATTR Value {inter_R}
SYMBOL res -176 1776 R0
SYMATTR InstName R73
SYMATTR Value 47k
SYMBOL res 1152 1776 R0
SYMATTR InstName R74
SYMATTR Value 47k
TEXT -5864 48 Left 6 !.tran 0 500ms 480ms 0.001ms startup
TEXT -5872 232 Left 6 !.param layer1R=20
TEXT -1952 408 Left 6 ;l1OSC2
TEXT -672 392 Left 6 ;l1OSC3
TEXT 568 360 Left 6 ;l1OSC4
TEXT 1976 384 Left 6 ;l1OSC5
TEXT -3328 392 Left 6 ;l1OSC1
TEXT -5216 1288 Left 6 !.option numdgt 7
TEXT -5160 1424 Left 6 !.option plotwinsize=0
TEXT -2176 4648 Left 6 ;l2OSC2
TEXT -920 4648 Left 6 ;l2OSC3
TEXT 344 4616 Left 6 ;l2OSC4
TEXT 1752 4624 Left 6 ;l2OSC5
TEXT -3576 4688 Left 6 ;l2OSC1
TEXT -5856 392 Left 6 !.param layer2R=1000
TEXT -5824 552 Left 6 !.param inter_R=1000

The netlist it stands for:
* coupled_wein_bridge.asc
V1 vee 0 15
V2 0 vcc 15
X§U1 N008 N003 vee vcc l1vout1 LT1001  ; OP07, pins In+ In- V+ V- OUT
R1 l1vout1 N003 100k
R2 N003 0 47k
R3 l1vout1 N013 1020
C1 N013 N008 0.1µ
R4 N008 0 1020
C2 N008 0 0.1µ
X§U2 N009 N004 vee vcc l1vout2 LT1001  ; OP07, pins In+ In- V+ V- OUT
R5 l1vout2 N004 100k
R6 N004 0 47k
R7 l1vout2 N014 1025
C3 N014 N009 0.1µ
R8 N009 0 1025
C4 N009 0 0.1µ
X§U3 N010 N005 vee vcc l1vout3 LT1001  ; OP07, pins In+ In- V+ V- OUT
R11 l1vout3 N005 100k
R12 N005 0 47k
R13 l1vout3 N015 1030
C5 N015 N010 0.1µ
R14 N010 0 1030
C6 N010 0 0.1µ
X§U4 N006 N001 vee vcc l1vout4 LT1001  ; OP07, pins In+ In- V+ V- OUT
R15 l1vout4 N001 100k
R16 N001 0 47k
R17 l1vout4 N011 1035
C7 N011 N006 0.1µ
R18 N006 0 1035
C8 N006 0 0.1µ
X§U5 N007 N002 vee vcc l1vout5 LT1001  ; OP07, pins In+ In- V+ V- OUT
R19 l1vout5 N002 100k
R20 N002 0 47k
R21 l1vout5 N012 1040
C9 N012 N007 0.1µ
R22 N007 0 1040
C10 N007 0 0.1µ
X§U6 N016 N023 vee vcc l2vout1 LT1001  ; OP07, pins In+ In- V+ V- OUT
R9 l2vout1 N023 100k
R10 N023 0 47k
R23 l2vout1 N028 270
C11 N028 N016 0.1µ
R24 N016 0 270
C12 N016 0 0.1µ
X§U7 N017 N024 vee vcc l2vout2 LT1001  ; OP07, pins In+ In- V+ V- OUT
R25 l2vout2 N024 100k
R26 N024 0 47k
R27 l2vout2 N029 271
C13 N029 N017 0.1µ
R28 N017 0 271
C14 N017 0 0.1µ
X§U8 N019 N025 vee vcc l2vout3 LT1001  ; OP07, pins In+ In- V+ V- OUT
R29 l2vout3 N025 100k
R30 N025 0 47k
R31 l2vout3 N030 272
C15 N030 N019 0.1µ
R32 N019 0 272
C16 N019 0 0.1µ
X§U9 N018 N021 vee vcc l2vout4 LT1001  ; OP07, pins In+ In- V+ V- OUT
R33 l2vout4 N021 100k
R34 N021 0 47k
R35 l2vout4 N026 273
C17 N026 N018 0.1µ
R36 N018 0 273
C18 N018 0 0.1µ
X§U10 N020 N022 vee vcc l2vout5 LT1001  ; OP07, pins In+ In- V+ V- OUT
R37 l2vout5 N022 100k
R38 N022 0 47k
R39 l2vout5 N027 274
C19 N027 N020 0.1µ
R40 N020 0 274
C20 N020 0 0.1µ
R41 l1vout3 l1vout1 {layer1R}
R42 l1vout4 l1vout1 {layer1R}
R43 l1vout5 l1vout1 {layer1R}
R44 l1vout4 l1vout2 {layer1R}
R45 l1vout5 l1vout2 {layer1R}
R46 l1vout5 l1vout3 {layer1R}
R47 N010 N008 47k
R48 N006 N008 47k
R49 N007 N008 47k
R50 N006 N009 47k
R51 N007 N009 47k
R52 N007 N010 47k
R53 l2vout3 l2vout1 {layer2R}
R54 l2vout4 l2vout1 {layer2R}
R55 N019 N016 47k
R56 N018 N016 47k
R57 l2vout3 l2vout2 {layer2R}
R58 l2vout4 l2vout2 {layer2R}
R59 l2vout5 l2vout2 {layer2R}
R60 N019 N017 47k
R61 N018 N017 47k
R62 N020 N017 47k
R63 l2vout5 l2vout3 {layer2R}
R64 N020 N019 47k
R65 l1vout5 l2vout2 {inter_R}
R66 l1vout5 l2vout3 {inter_R}
R67 l1vout5 l2vout4 {inter_R}
R68 N007 N019 47k
R69 N007 N017 47k
R70 N007 N018 47k
R71 l1vout5 l2vout1 {inter_R}
R72 l1vout5 l2vout5 {inter_R}
R73 N007 N016 47k
R74 N007 N020 47k
.tran 0 500ms 480ms 0.001ms startup
.param layer1R=20
* l1OSC2
* l1OSC3
* l1OSC4
* l1OSC5
* l1OSC1
.option numdgt 7
.option plotwinsize=0
* l2OSC2
* l2OSC3
* l2OSC4
* l2OSC5
* l2OSC1
.param layer2R=1000
.param inter_R=1000
.lib LTC.lib
.backanno
.end